# EAGLE design power_control (EAGLE 7.2.0)

## Sheet 1 of 5: Power
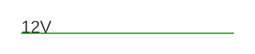
[diagram p0: schematic, sheet 1]

## Sheet 2 of 5: B-t-B
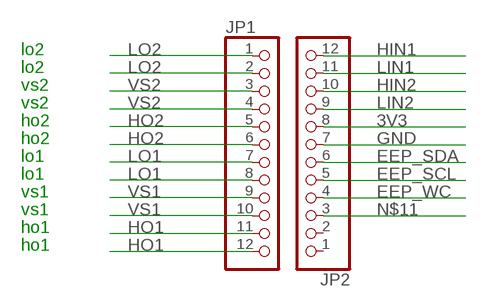
[diagram p1: schematic, sheet 2]

### Parts
JP1  PINHD-1X12_2.54-SMD  [1X12SMD]
JP2  PINHD-1X12_2.54-SMD  [1X12SMD]

### Nets
3V3: JP2.8 ; also sheet 4
EEP_SCL: JP2.5 ; also sheet 4
EEP_SDA: JP2.6 ; also sheet 4
EEP_WC: JP2.4 ; also sheet 4
GND: JP2.7 ; also sheet 3,4,5
HIN1: JP2.12 ; also sheet 3
HIN2: JP2.10 ; also sheet 3
HO1: JP1.11 JP1.12 ; also sheet 3
HO2: JP1.5 JP1.6 ; also sheet 3
LIN1: JP2.11 ; also sheet 3
LIN2: JP2.9 ; also sheet 3
LO1: JP1.7 JP1.8 ; also sheet 3
LO2: JP1.1 JP1.2 ; also sheet 3
N$11: JP2.3
VS1: JP1.9 JP1.10 ; also sheet 3
VS2: JP1.3 JP1.4 ; also sheet 3
Unconnected: JP2.1 JP2.2

### Notes on the sheet
- lo2
- lo2
- vs2
- vs2
- ho2
- ho2
- lo1
- lo1
- vs1
- vs1
- ho1
- ho1

## Sheet 3 of 5: IR2101
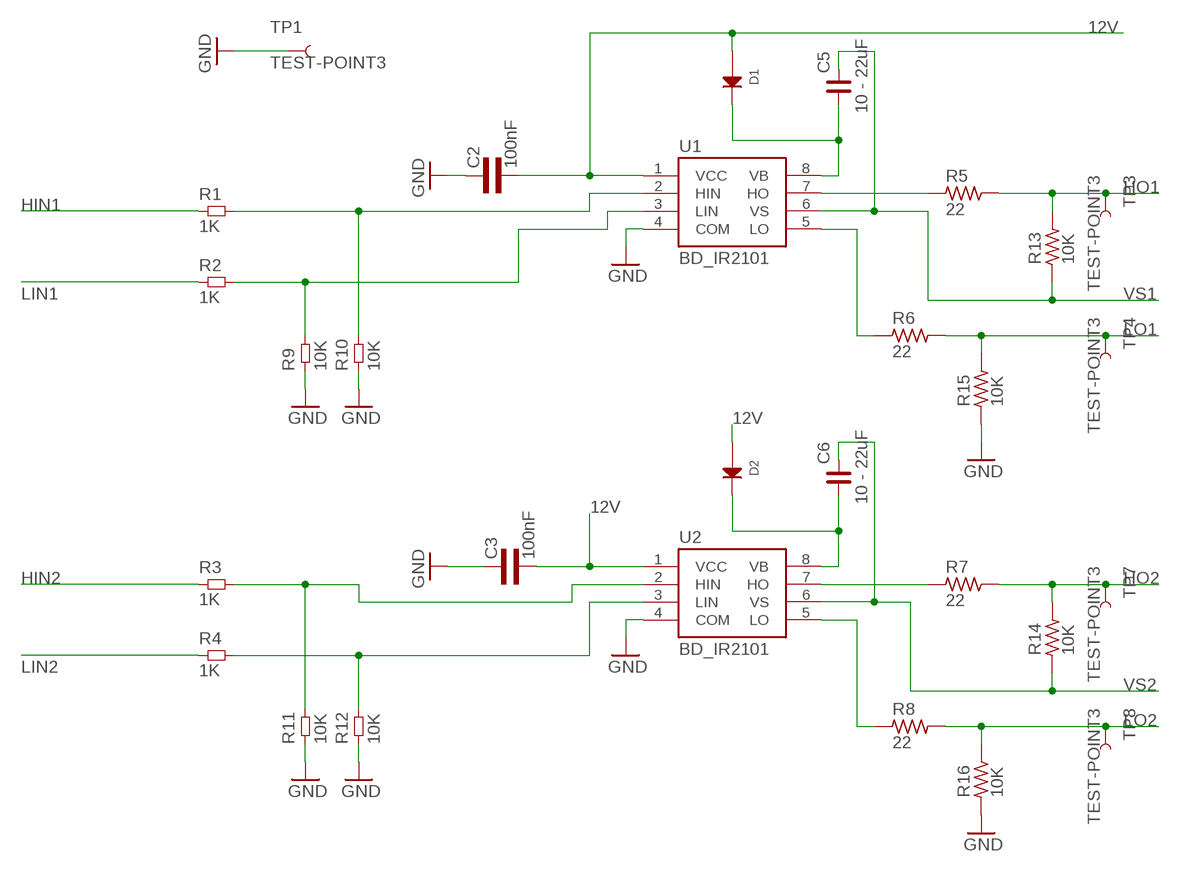
[diagram p2: schematic, sheet 3]

### Parts
C2  100nF  CAP0603L3  [0603L3]
C3  100nF  CAP0603L3  [0603L3]
C5  10 - 22uF  C_0805  [C0805]
C6  10 - 22uF  C_0805  [C0805]
D1  DIODETMINIP2-F2-B  [TMINIP2-F2-B]
D2  DIODETMINIP2-F2-B  [TMINIP2-F2-B]
R1  1K  RES0603L3  [0603L3]
R2  1K  RES0603L3  [0603L3]
R3  1K  RES0603L3  [0603L3]
R4  1K  RES0603L3  [0603L3]
R5  22  R_0805  [R0805]
R6  22  R_0805  [R0805]
R7  22  R_0805  [R0805]
R8  22  R_0805  [R0805]
R9  10K  RES0603L3  [0603L3]
R10  10K  RES0603L3  [0603L3]
R11  10K  RES0603L3  [0603L3]
R12  10K  RES0603L3  [0603L3]
R13  10K  R_0805  [R0805]
R14  10K  R_0805  [R0805]
R15  10K  R_0805  [R0805]
R16  10K  R_0805  [R0805]
TP1  TEST-POINT3  [PAD.03X.03]
TP3  TEST-POINT3  [PAD.03X.03]
TP4  TEST-POINT3  [PAD.03X.03]
TP7  TEST-POINT3  [PAD.03X.03]
TP8  TEST-POINT3  [PAD.03X.03]
U1  BD_IR2101  [SO8]
U2  BD_IR2101  [SO8]

### Nets
12V: C2.P$2 C3.P$2 D1.2(ANODE) D2.2(ANODE) U1.1(VCC) U2.1(VCC) ; also sheet 1,5
GND: C2.P$1 C3.P$1 R9.P$1 R10.P$1 R11.P$1 R12.P$1 R15.1 R16.1 TP1.P$1 U1.4(COM) U2.4(COM) ; also sheet 2,4,5
HIN1: R1.P$1 ; also sheet 2
HIN2: R3.P$1 ; also sheet 2
HO1: R5.2 R13.2 TP3.P$1 ; also sheet 2
HO1_OUT: R5.1 U1.7(HO)
HO2: R7.2 R14.2 TP7.P$1 ; also sheet 2
HO2_OUT: R7.1 U2.7(HO)
LIN1: R2.P$1 ; also sheet 2
LIN2: R4.P$1 ; also sheet 2
LO1: R6.2 R15.2 TP4.P$1 ; also sheet 2
LO2: R8.2 R16.2 TP8.P$1 ; also sheet 2
N$7: R1.P$2 R10.P$2 U1.2(HIN)
N$12: R2.P$2 R9.P$2 U1.3(LIN)
N$20: R6.1 U1.5(LO)
N$33: R3.P$2 R11.P$2 U2.2(HIN)
N$34: R4.P$2 R12.P$2 U2.3(LIN)
N$40: R8.1 U2.5(LO)
VB1: C5.1 D1.1(CATHODE) U1.8(VB)
VB2: C6.1 D2.1(CATHODE) U2.8(VB)
VS1: C5.2 R13.1 U1.6(VS) ; also sheet 2
VS2: C6.2 R14.1 U2.6(VS) ; also sheet 2

## Sheet 4 of 5: EEPROM
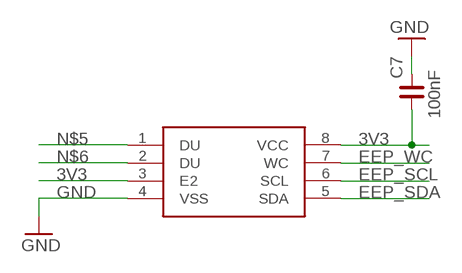
[diagram p3: schematic, sheet 4]

### Parts
C7  100nF  C_0201  [C0201]
M24M02  M24M02-DRMN6TP  [SO08]

### Nets
3V3: C7.1 M24M02.3(E2) M24M02.8(VCC) ; also sheet 2
EEP_SCL: M24M02.6(SCL) ; also sheet 2
EEP_SDA: M24M02.5(SDA) ; also sheet 2
EEP_WC: M24M02.7(WC) ; also sheet 2
GND: C7.2 M24M02.4(VSS) ; also sheet 2,3,5
N$5: M24M02.1(DU)
N$6: M24M02.2(DU)

## Sheet 5 of 5
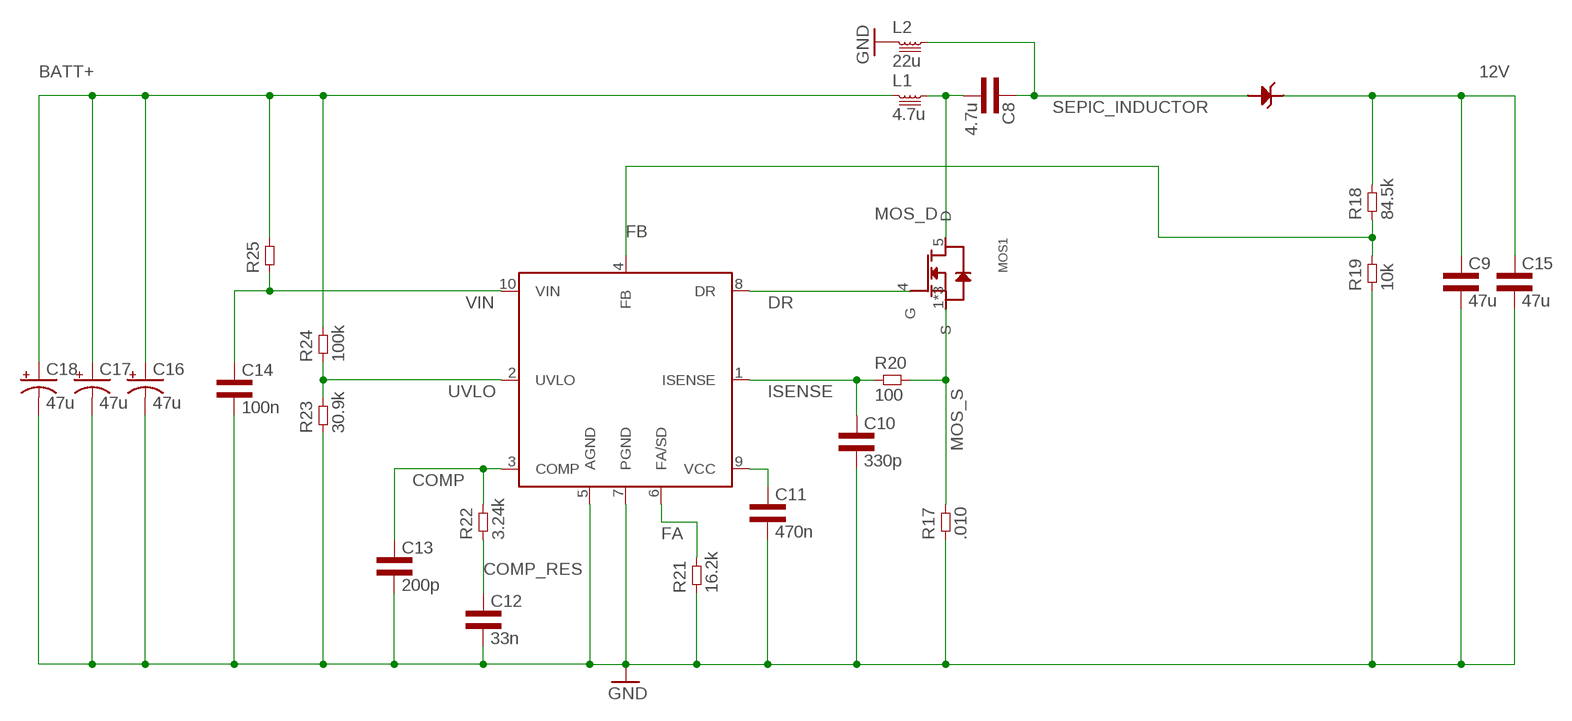
[diagram p4: schematic, sheet 5]

### Parts
C8  4.7u  CAP1206L3  [1206L3]
C9  47u  CAP1210L3  [1210L3]
C10  330p  CAP0402L3  [0402L3]
C11  470n  CAP0402L3  [0402L3]
C12  33n  CAP0402L3  [0402L3]
C13  200p  CAP0402L3  [0402L3]
C14  100n  CAP0603L3  [0603L3]
C15  47u  CAP1210L3  [1210L3]
C16  47u  CPOL-USCT7343  [CT7343]
C17  47u  CPOL-USCT7343  [CT7343]
C18  47u  CPOL-USCT7343  [CT7343]
D3  SCHOTTKYDIODEDPAK  [DPAK]
L1  4.7u  INDUCTORSRP6540  [SRP6540]
L2  22u  INDUCTORIHLP3232DZ11  [IHLP3232DZ11]
MOS1  MOSFET-NPG-TDSON-8  [PG-TDSON-8]
R17  .010  RES1206L3  [1206L3]
R18  84.5k  RES0402L3  [0402L3]
R19  10k  RES0402L3  [0402L3]
R20  100  RES0402L3  [0402L3]
R21  16.2k  RES0402L3  [0402L3]
R22  3.24k  RES0402L3  [0402L3]
R23  30.9k  RES0402L3  [0402L3]
R24  100k  RES0402L3  [0402L3]
R25  RES0402L3  [0402L3]
U3  LM3481  [S-PDSO-G10]

### Nets
12V: C9.P$1 C15.P$1 D3.TAB(CATHODE) R18.P$2 ; also sheet 1,3
BATT+: C16.+ C17.+ C18.+ L1.1 R24.P$2 R25.P$2
COMP: C13.P$1 R22.P$2 U3.3(COMP)
COMP_RES: C12.P$1 R22.P$1
DR: MOS1.4(G) U3.8(DR)
FA: R21.P$2 U3.6(FA/SD)
FB: R18.P$1 R19.P$2 U3.4(FB)
GND: C9.P$2 C10.P$2 C11.P$2 C12.P$2 C13.P$2 C14.P$2 C15.P$2 C16.- C17.- C18.- L2.1 R17.1 R19.P$1 R21.P$1 R23.P$1 U3.5(AGND) U3.7(PGND) ; also sheet 2,3,4
ISENSE: C10.P$1 R20.P$1 U3.1(ISENSE)
MOS_D: C8.2 L1.2 MOS1.5(D)
MOS_S: MOS1.1(S) MOS1.2(S) MOS1.3(S) R17.2 R20.P$2
N$14: C11.P$1 U3.9(VCC)
SEPIC_INDUCTOR: C8.1 D3.1(ANODE) D3.3(ANODE) L2.2
UVLO: R23.P$2 R24.P$1 U3.2(UVLO)
VIN: C14.P$1 R25.P$1 U3.10(VIN)

## Library data of the parts
C2 C3 C8-C15 = common:CAP
C5-C7 = rc-master-smd:C_: NON-POLARIZED CAP
C16-C18 = rcl:CPOL-US: POLARIZED CAPACITOR, American symbol
D1 D2 = common:DIODE; PARTNUM: DB2441600L
D3 = common:SCHOTTKYDIODE
JP1 JP2 = pinhead-1:PINHD-1X12: PIN HEADER
L1 L2 = common:INDUCTOR
M24M02 = st-microelectronics:M24M02-DRMN6TP
MOS1 = common:MOSFET-N
R1-R4 R9-R12 R17-R25 = common:RES
R5-R8 R13-R16 = rc-master-smd:R_: RESISTOR
TP1 TP3 TP4 TP7 TP8 = SparkFun-Passives:TEST-POINT: Bare copper test points for troubleshooting or ICT
U1 U2 = open-bldc:BD
U3 = common:LM3481

## Board
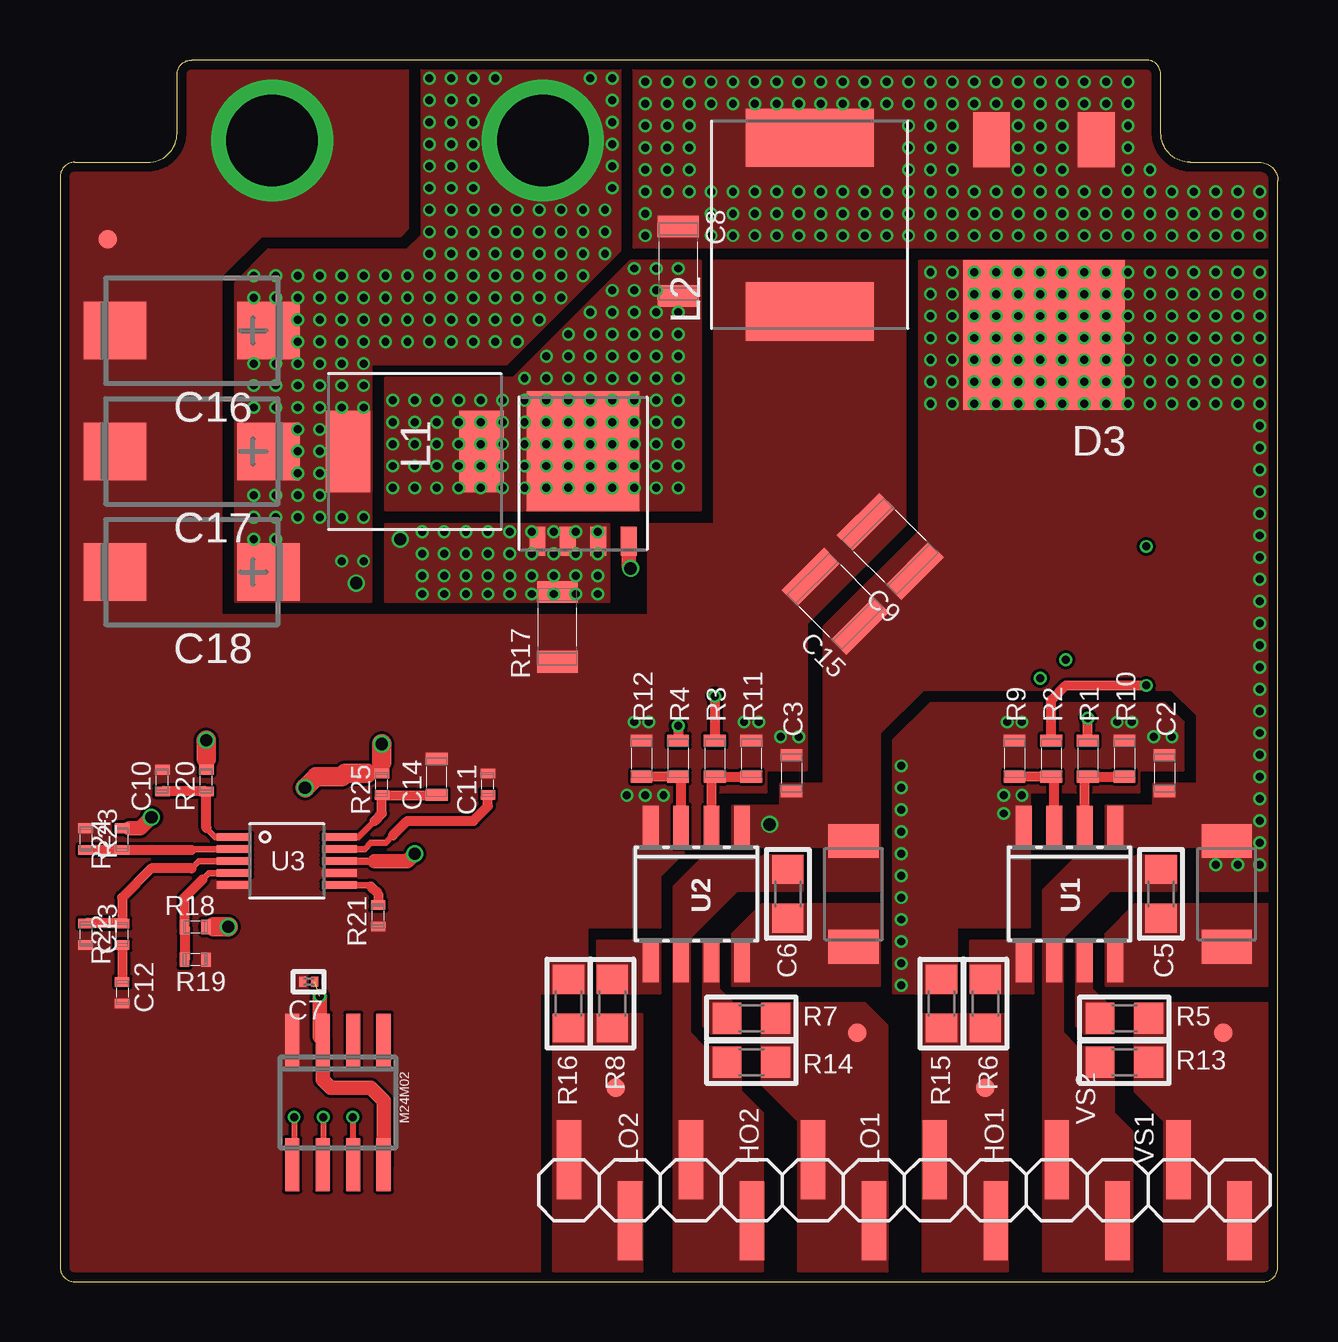
[diagram p5: board, top side]
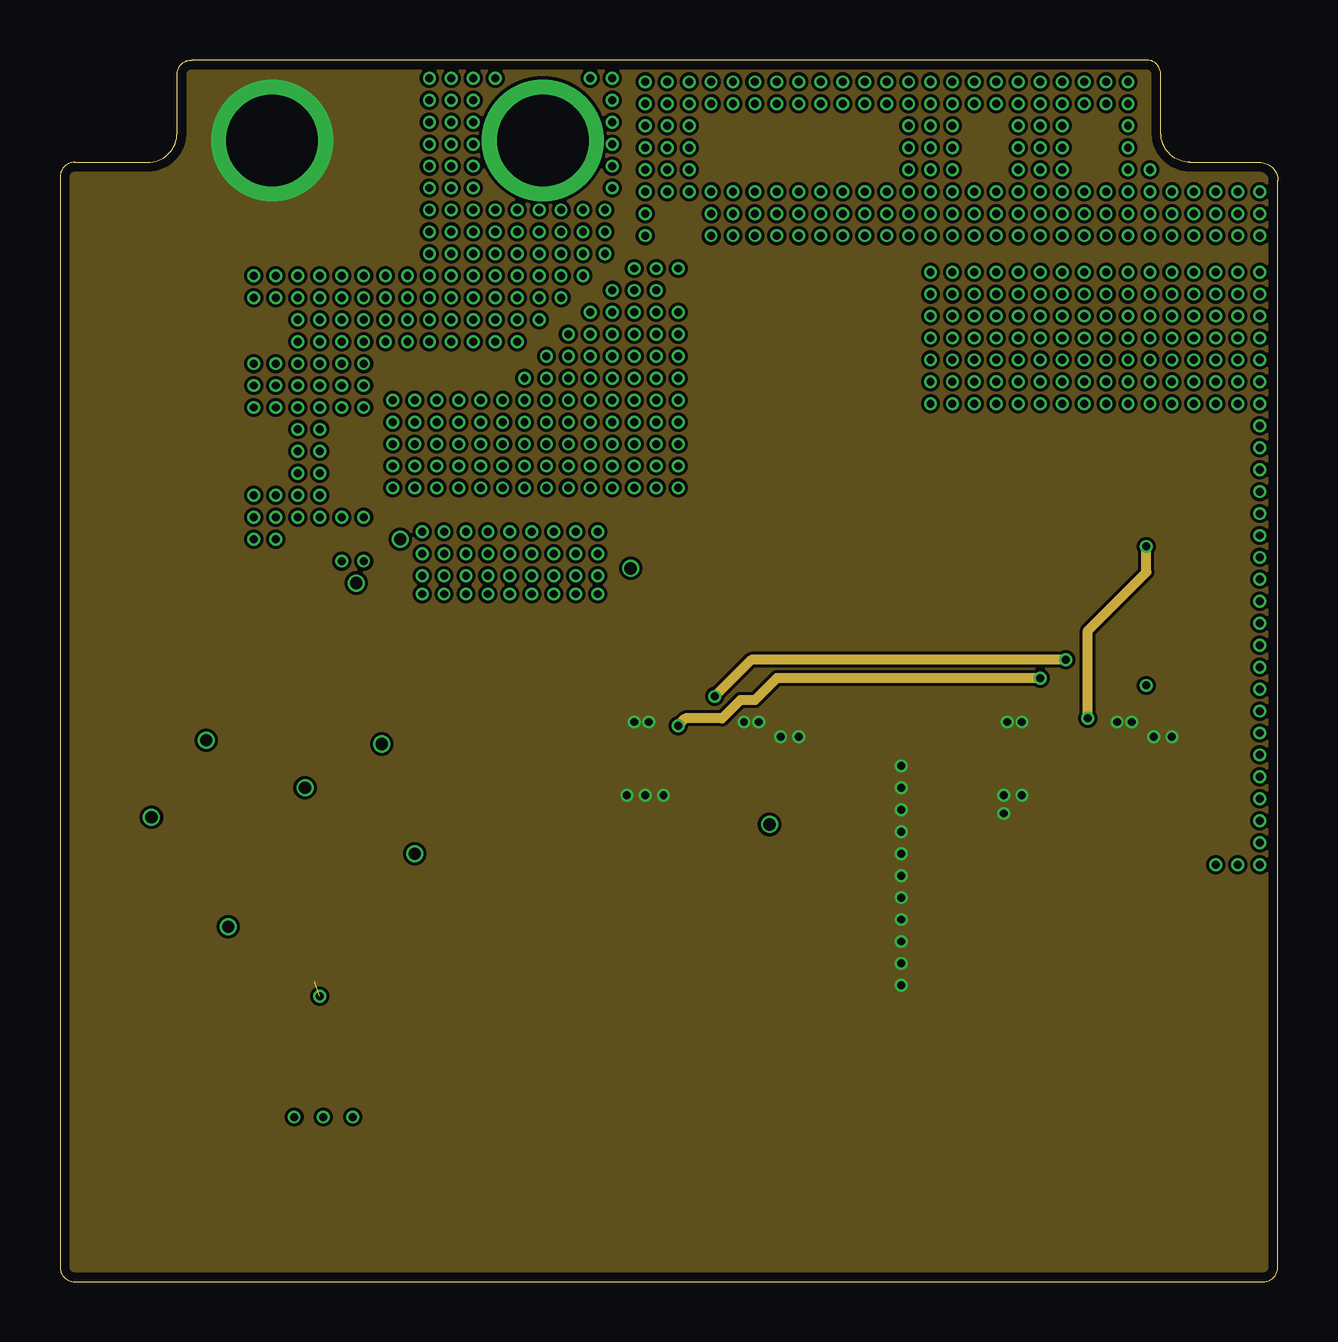
[diagram p6: board, inner layer Route2]
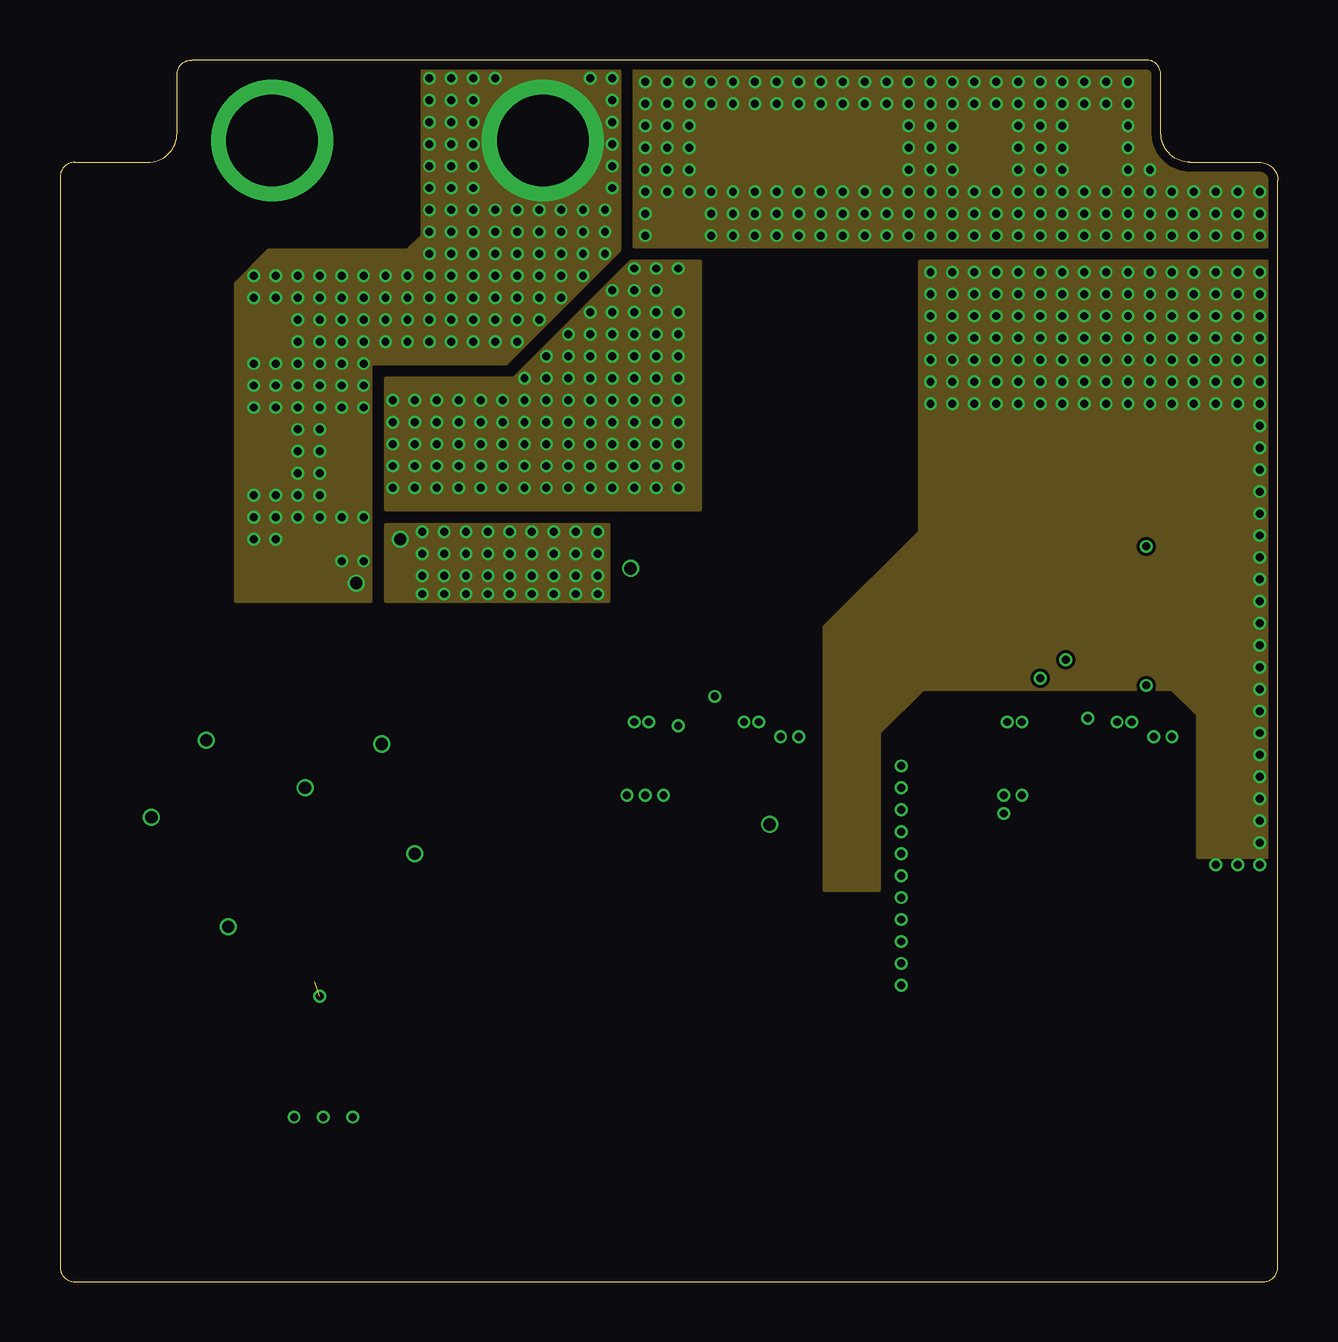
[diagram p7: board, inner layer Route3]
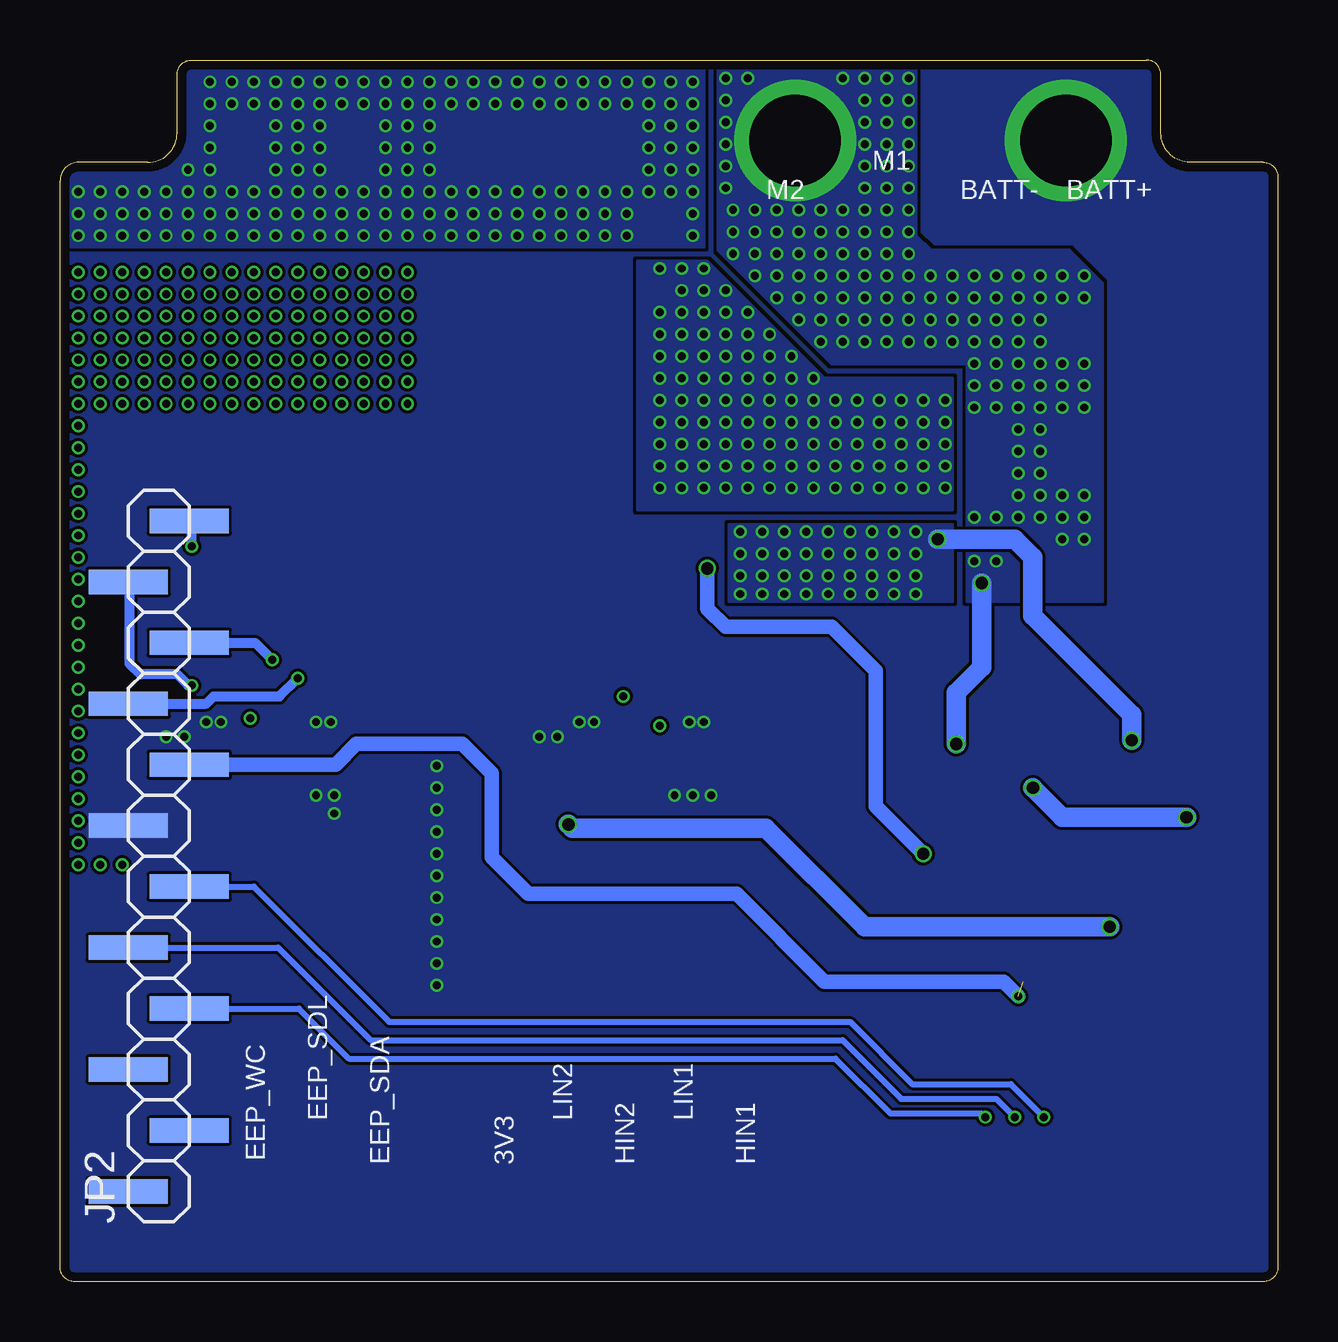
[diagram p8: board, bottom side, seen from below]

Size 50.75 x 50.9 mm. Coordinates in mm from the lower left corner, seen from the top.
Outline: 0.61,0 50.14,0 arc90 50.75,0.61 50.75,45.87 arc90 49.99,46.63 47.09,46.63 arc-90 45.87,47.85 45.87,50.29 arc90 45.26,50.9 5.49,50.9 arc90 4.88,50.29 4.88,47.85 arc-90 3.66,46.63 0.61,46.63 arc90 0,46.02 0,0.61 arc90 0.61,0
Copper layers (1*2*3*16): Top 0.035559375mm / dielectric 0.17018125mm / Route2 0.01778125mm / dielectric 47mil / Route3 0.01778125mm / dielectric 0.17018125mm / Bottom 0.035559375mm
Design rules "LaenPCBOrder *": minimum track width 5mil, minimum drill 10mil, track to track 5mil, track to pad 5mil, pad to pad 5mil, via to via 5mil, smd to smd 0mil, copper to edge 15mil, drill to drill 6mil, minimum pad ring 4mil, minimum via ring 4mil, stop-mask expansion 4mil, vias tented up to drill 21mil, thermal gap 10mil

### Footprints (pad centres in the part's own frame; a part is rotated, then mirrored left to right if it is on the bottom)
0603L3 = smd 0.5 x 0.9: P$1 -0.75,0; P$2 0.75,0
C0805 = smd 1.2 x 1.3: 1 -1.016,0; 2 1.016,0
C0201 = smd 0.3 x 0.4: 1 -0.254,0; 2 0.254,0
1206L3 = smd 0.9 x 1.7: 1 -1.45,0; 2 1.45,0
1210L3 = smd 0.9 x 2.5: P$1 -1.45,0; P$2 1.45,0
0402L3 = smd 0.4 x 0.6: P$1 -0.45,0; P$2 0.45,0
CT7343 = smd 2.6 x 2.4: + -3.2,0; - 3.2,0
TMINIP2-F2-B = smd 1.4 x 2.1: 1 -2.2,0; 2 2.2,0
DPAK = smd 1.524 x 2.28: 1 -2.18,-5.06; 3 2.18,-5.06 | smd 6.74 x 6.23: TAB 0,3.085
1X12SMD = smd 1.016 x 3.302: 1 -1.27,1.27; 2 1.27,-1.27; 3 3.81,1.27; 4 6.35,-1.27; 5 8.89,1.27; 6 11.43,-1.27; 7 13.97,1.27; 8 16.51,-1.27; 9 19.05,1.27; 10 21.59,-1.27; 11 24.13,1.27; 12 26.67,-1.27
SRP6540 = smd 1.85 x 3.4: 1 -2.775,0; 2 2.775,0
IHLP3232DZ11 = smd 2.423 x 5.334: 1 -3.619,0; 2 3.619,0
SO08 = smd 0.6 x 2.2: 1 -1.905,-2.6; 2 -0.635,-2.6; 3 0.635,-2.6; 4 1.905,-2.6; 5 1.905,2.6; 6 0.635,2.6; 7 -0.635,2.6; 8 -1.905,2.6
PG-TDSON-8 = smd 0.65 x 1.2: 1 -1.905,-2.825; 2 -0.635,-2.825; 3 0.635,-2.825; 4 1.905,-2.825 | smd 4.7 x 5: 5 0,0.925
R0805 = smd 1.2 x 1.3: 1 -1.016,0; 2 1.016,0
PAD.03X.03 = smd 0.762 x 0.762: P$1 0,0
SO8 = smd 0.65 x 1.75: 1 -1.905,-2.8; 2 -0.635,-2.8; 3 0.635,-2.8; 4 1.905,-2.8; 5 1.905,2.8; 6 0.635,2.8; 7 -0.635,2.8; 8 -1.905,2.8
S-PDSO-G10 = smd 0.3 x 1.45: 1 -1,-2.2; 2 -0.5,-2.2; 3 0,-2.2; 4 0.5,-2.2; 5 1,-2.2; 6 1,2.2; 7 0.5,2.2; 8 0,2.2; 9 -0.5,2.2; 10 -1,2.2

### Placement (x,y rotation side)
C2  46.02,21.18 270 top
C3  30.48,21.18 270 top
C5  45.87,16.15 90 top
C6  30.33,16.15 90 top
C7  10.36,12.5 180 top
C8  25.76,42.52 270 top
C9  34.59,30.63 135 top
C10  4.27,20.88 90 top
C11  17.83,20.73 90 top
C12  2.59,12.04 270 top
C13  1.07,14.48 270 top
C14  15.7,21.03 90 top
C15  32.31,28.35 135 top
C16  5.49,39.62 180 top
C17  5.49,34.59 180 top
C18  5.49,29.57 180 top
D1  48.62,16.15 90 top
D2  33.07,16.15 90 top
D3  41,42.52 180 top
JP1  22.48,3.81 0 top
JP2  46.63,5.03 90 bottom
L1  14.78,34.59 0 top
L2  31.24,44.04 90 top
M24M02  11.58,7.47 180 top
MOS1  21.79,33.68 0 top
R1  42.82,21.79 270 top
R2  41.3,21.79 270 top
R3  27.28,21.79 270 top
R4  25.76,21.79 270 top
R5  44.35,10.97 0 top
R6  38.56,11.58 270 top
R7  28.8,10.97 0 top
R8  23.01,11.58 270 top
R9  39.78,21.79 270 top
R10  44.35,21.79 270 top
R11  28.8,21.79 270 top
R12  24.23,21.79 270 top
R13  44.35,9.14 0 top
R14  28.8,9.14 0 top
R15  36.73,11.58 270 top
R16  21.18,11.58 270 top
R17  20.73,27.28 90 top
R18  5.64,14.78 0 top
R19  5.64,13.41 180 top
R20  6.1,20.88 90 top
R21  13.26,15.24 90 top
R22  2.59,14.48 90 top
R23  1.07,18.44 270 top
R24  2.59,18.44 90 top
R25  13.41,20.73 90 top
TP1  1.98,43.43 0 top
TP3  48.46,10.36 0 top
TP4  38.56,8.08 0 top
TP7  33.22,10.36 0 top
TP8  23.16,8.08 0 top
U1  42.06,16.15 180 top
U2  26.52,16.15 180 top
U3  9.45,17.53 270 top

### Tracks (layer width: path | path; a pad name or v marks a point on that pad's centre or on a via)
3V3  (via drill 0.33)  (1 unrouted)
  Top 0.61: v10.82,11.89 10.82,10.19 M24M02.3 10.95,8.41 11.28,8.08 12.95,8.08 13.49,7.54 M24M02.8
  Bottom 0.61: JP2.8 39.27,21.54 38.41,22.4 33.98,22.4 32.77,21.18 32.77,17.68 31.24,16.15 22.56,16.15 18.9,12.5 11.43,12.5 v10.82,11.89
12V  (via drill 0.33, 0.51)
  Top 0.406: R18.P$2 6.4,14.78
  Top 0.813: 6.4,14.78 v7.01,14.78
  Bottom 0.813: v29.57,19.05 29.41,18.9 21.34,18.9 17.22,14.78 v7.01,14.78
  other vias: 36.27,42.06 37.19,42.06 38.1,42.06 39.01,42.06 39.93,42.06 40.84,42.06 41.76,42.06 42.67,42.06 43.59,42.06 44.5,42.06 45.42,42.06 46.33,42.06 47.24,42.06 48.16,42.06 49.07,42.06 49.99,42.06 49.99,41.15 49.99,40.23 49.99,39.32 49.99,38.4 49.99,37.49 49.99,36.58 49.99,35.66 49.99,34.75 49.99,33.83 49.99,32.92 49.99,32 49.99,31.09 49.99,30.18 49.99,29.26 49.99,28.35 49.99,27.43 49.99,26.52 49.99,25.6 49.99,24.69 49.99,23.77 49.99,22.86 49.99,21.95 49.99,21.03 49.99,20.12 49.99,19.2 49.99,18.29 49.99,17.37 49.07,17.37 48.16,17.37 49.07,41.15 49.07,40.23 49.07,39.32 49.07,38.4 49.07,37.49 49.07,36.58 48.16,41.15 48.16,40.23 48.16,39.32 48.16,38.4 48.16,37.49 48.16,36.58 36.27,41.15 36.27,40.23 36.27,39.32 36.27,38.4 36.27,37.49 36.27,36.58 37.19,41.15 38.1,41.15 39.01,41.15 39.93,41.15 40.84,41.15 41.76,41.15 37.19,40.23 38.1,40.23 39.01,40.23 39.93,40.23 40.84,40.23 41.76,40.23 37.19,39.32 38.1,39.32 37.19,38.4 37.19,37.49 37.19,36.58 38.1,38.4 38.1,37.49 38.1,36.58 39.01,39.32 39.01,38.4 39.01,37.49 39.01,36.58 39.93,39.32 39.93,38.4 39.93,37.49 39.93,36.58 40.84,39.32 40.84,38.4 40.84,37.49 40.84,36.58 41.76,39.32 41.76,38.4 41.76,37.49 41.76,36.58 42.67,41.15 43.59,41.15 44.5,41.15 45.42,41.15 46.33,41.15 47.24,41.15 42.67,40.23 43.59,40.23 44.5,40.23 45.42,40.23 46.33,40.23 47.24,40.23 42.67,39.32 43.59,39.32 44.5,39.32 45.42,39.32 46.33,39.32 47.24,39.32 42.67,38.4 43.59,38.4 44.5,38.4 45.42,38.4 46.33,38.4 47.24,38.4 42.67,37.49 43.59,37.49 44.5,37.49 45.42,37.49 46.33,37.49 47.24,37.49 42.67,36.58 43.59,36.58 44.5,36.58 45.42,36.58 46.33,36.58 47.24,36.58
  pour Top (no thermals): 28.04,19.81 30.02,19.81 30.02,20.73 34.14,20.73 34.14,17.68 32,17.68 32,18.14 28.04,18.14
  pour Top (no thermals): 43.59,19.81 45.57,19.81 45.57,20.73 50.29,20.73 50.29,16.31 47.4,16.31 47.4,18.14 43.59,18.14
  pour Top (no thermals): 34.14,16.31 34.14,22.86 35.97,24.69 46.33,24.69 47.4,23.62 47.4,17.68 50.29,17.68 50.29,42.52 35.81,42.52 35.81,31.24 31.85,27.28 31.85,16.31
  pour Route3 (no thermals): 34.14,16.31 34.14,22.86 35.97,24.69 46.33,24.69 47.4,23.62 47.4,17.68 50.29,17.68 50.29,42.52 35.81,42.52 35.81,31.24 31.85,27.28 31.85,16.31
BATT+  (via drill 0.33, 0.51, 3.81 pad 5.08)
  Top 0.406: 13.41,21.64 R25.P$2 12.8,21.18 | R24.P$2 2.89,18.89 2.9,18.9
  Top 0.61: 2.9,18.9 3.35,18.9 v3.81,19.35
  Top 0.813: v13.41,22.4 13.41,21.64 | v10.21,20.57 10.67,21.03 11.73,21.03 11.89,21.18 12.8,21.18
  Bottom 0.813: v12.34,29.11 12.34,25.6 13.41,24.54 v13.41,22.4 | v3.81,19.35 8.99,19.35 v10.21,20.57
  other vias: 20.12,47.55 15.39,50.14 16.31,50.14 17.22,50.14 18.14,50.14 15.39,49.23 16.31,49.23 17.22,49.23 15.39,48.31 16.31,48.31 17.22,48.31 15.39,47.4 16.31,47.4 17.22,47.4 23.01,50.14 22.1,50.14 23.01,49.23 23.01,48.31 23.01,47.4 15.39,46.48 16.31,46.48 17.22,46.48 23.01,46.48 23.01,45.57 15.39,44.65 16.31,44.65 17.22,44.65 18.14,44.65 19.05,44.65 19.96,44.65 20.88,44.65 21.79,44.65 22.71,44.65 21.79,43.74 20.88,43.74 19.96,43.74 19.05,43.74 18.14,43.74 17.22,43.74 16.31,43.74 15.39,43.74 8.99,41.91 8.08,41.91 9.91,41.91 10.82,41.91 12.65,41.91 14.48,41.91 16.31,41.91 15.39,41.91 15.39,42.82 16.31,42.82 17.22,42.82 18.14,42.82 19.05,42.82 19.96,42.82 20.88,42.82 8.99,41 8.08,41 11.73,41.91 13.56,41.91 21.79,41.91 20.88,41.91 19.96,41.91 19.05,41.91 18.14,41.91 17.22,41.91 22.71,42.82 21.79,42.82 15.39,45.57 16.31,45.57 17.22,45.57 22.71,43.74 9.91,41 10.82,41 11.73,41 12.65,41 13.56,41 14.48,41 15.39,41 16.31,41 17.22,41 18.14,41 19.05,41 19.96,41 20.88,41 19.96,40.08 19.05,40.08 19.05,39.17 18.14,40.08 18.14,39.17 17.22,40.08 17.22,39.17 16.31,39.17 16.31,40.08 15.39,40.08 15.39,39.17 14.48,39.17 14.48,40.08 13.56,40.08 12.65,40.08 13.56,39.17 12.65,39.17 11.73,40.08 10.82,40.08 9.91,40.08 11.73,39.17 10.82,39.17 9.91,39.17 9.91,38.25 10.82,38.25 11.73,38.25 12.65,38.25 9.91,37.34 9.91,36.42 9.91,35.51 10.82,37.34 11.73,37.34 12.65,37.34 10.82,36.42 11.73,36.42 12.65,36.42 10.82,35.51 8.99,38.25 8.08,38.25 8.08,37.34 8.99,37.34 8.99,36.42 8.08,36.42 9.91,34.59 9.91,33.68 10.82,34.59 10.82,33.68 9.91,32.77 10.82,32.77 8.99,32.77 8.08,32.77 8.08,31.85 8.99,31.85 9.91,31.85 10.82,31.85 11.73,31.85 12.65,31.85 8.08,30.94 8.99,30.94 11.73,30.02 12.65,30.02
  pour Top (no thermals): 15.09,50.9 15.09,43.59 14.48,42.98 8.69,42.98 7.32,41.61 7.32,28.35 12.95,28.35 12.95,38.25 18.59,38.25 23.32,42.98 23.32,50.9
  pour Route3 (no thermals): 15.09,50.9 15.09,43.59 14.48,42.98 8.69,42.98 7.32,41.61 7.32,28.35 12.95,28.35 12.95,38.25 18.59,38.25 23.32,42.98 23.32,50.9
  pour Bottom (no thermals): 15.09,50.9 15.09,43.59 14.48,42.98 8.69,42.98 7.32,41.61 7.32,28.35 12.95,28.35 12.95,38.25 18.59,38.25 23.32,42.98 23.32,50.9
COMP
  Top 0.279: U3.3 5.79,17.53 5.49,17.22
  Top 0.406: 5.49,17.22 3.81,17.22 2.59,16 R22.P$2 C13.P$1
COMP_RES
  Top 0.406: R22.P$1 C12.P$1
DR  (via drill 0.51)
  Top 0.305: U3.8 13.11,17.53
  Top 0.61: MOS1.4 23.7,29.79 v23.77,29.72 | 13.11,17.53 14.48,17.53 v14.78,17.83
  Bottom 0.61: v23.77,29.72 23.77,28.04 23.01,27.28 18.59,27.28 16.76,25.45 16.76,19.81 v14.78,17.83
EEP_SCL  (via drill 0.33)
  Top 0.254: v10.97,6.86 10.97,4.89 M24M02.6
  Bottom 0.254: JP2.5 41.66,13.92 37.8,10.06 18.14,10.06 15.7,7.62 11.73,7.62 v10.97,6.86
EEP_SDA  (via drill 0.33)
  Top 0.254: v9.75,6.86 9.75,4.94 M24M02.5
  Bottom 0.254: JP2.6 42.67,16.46 37.03,10.82 17.83,10.82 15.24,8.23 11.12,8.23 v9.75,6.86
EEP_WC  (via drill 0.33)
  Top 0.254: v12.19,6.86 12.19,4.89 M24M02.7
  Bottom 0.254: JP2.4 40.79,11.38 38.71,9.3 18.44,9.3 16.15,7.01 12.34,7.01 v12.19,6.86
FA
  Top 0.279: U3.6 12.89,16.53 12.95,16.46
  Top 0.406: 12.95,16.46 13.26,16.15 R21.P$2
FB
  Top 0.279: U3.4 6.21,17.03 5.94,16.76
  Top 0.406: 5.94,16.76 5.19,16.01 R18.P$1 R19.P$2
GND  (via drill 0.33, 3.81 pad 5.08)
  other vias: 8.84,47.55 35.05,12.34 35.05,13.26 35.05,14.17 35.05,15.09 35.05,16 35.05,16.92 35.05,17.83 35.05,18.75 35.05,19.66 35.05,20.57 35.05,21.49 44.04,23.32 45.57,22.71 39.47,23.32 40.08,23.32 44.65,23.32 46.33,22.71 30.02,22.71 30.78,22.71 28.5,23.32 29.11,23.32 23.93,23.32 24.54,23.32 25.15,20.27 24.38,20.27 23.62,20.27 40.08,20.27 39.32,20.27 39.32,19.51
  pour Top (no thermals): 14.48,50.44 0.3,50.44 0.3,0.15 19.96,0.15 19.96,12.04 21.95,12.04 21.95,14.78 24.99,14.78 24.99,16.92 26.21,18.14 27.43,18.14 27.43,20.42 29.41,20.42 29.41,21.34 31.09,21.34 31.09,27.43 35.2,31.55 35.2,42.52 27.28,42.52 27.28,31.55 24.54,31.55 24.54,27.74 6.71,27.74 6.71,41.91 8.38,43.59 14.17,43.59 14.48,43.89
  pour Top (no thermals): 34.75,12.04 34.75,22.56 36.27,24.08 46.02,24.08 46.79,23.32 46.79,21.34 44.96,21.34 44.96,20.42 40.39,20.42 40.39,14.78 37.34,14.78 37.34,12.04
  pour Bottom (rank 6, no thermals): 50.6,0.15 0.15,0.15 0.15,50.75 45.11,50.75 50.6,50.75
  pour Route2 (no thermals): 50.6,0.15 0.15,0.15 0.15,50.75 45.11,50.75 50.6,50.75
HIN1  (via drill 0.33)
  Top 0.406: R1.P$1 v42.82,23.47
  Route2 0.406: v42.82,23.47 42.82,27.13 45.26,29.57 v45.26,30.63
  Bottom 0.406: v45.26,30.63 45.26,31.6 JP2.12
HIN2  (via drill 0.33)
  Top 0.406: v27.28,24.38 R3.P$1
  Route2 0.406: v41.91,25.91 28.8,25.91 v27.28,24.38
  Bottom 0.406: JP2.10 42.62,26.62 v41.91,25.91
HO1
  pour Top (no thermals): 44.81,11.58 44.81,7.92 46.02,6.71 46.02,0.46 50.6,0.46 50.6,11.58
HO1_OUT
  pour Top (no thermals): 42.98,14.17 42.98,12.19 43.59,11.58 43.89,11.58 43.89,10.36 42.67,10.36 42.37,10.67 42.37,14.17
HO2
  pour Top (no thermals): 29.26,11.58 33.53,11.58 34.44,10.67 34.44,0.46 30.78,0.46 30.78,6.71 29.26,8.23
HO2_OUT
  pour Top (no thermals): 27.43,14.17 27.43,12.19 28.04,11.58 28.35,11.58 28.35,10.36 27.13,10.36 26.82,10.67 26.82,14.17
ISENSE
  Top 0.279: U3.1 6.47,18.53 6.1,18.9
  Top 0.406: 6.1,18.9 R20.P$1 C10.P$1
LIN1  (via drill 0.33)
  Top 0.406: R2.P$1 41.3,24.23 41.91,24.84 v45.26,24.84
  Bottom 0.406: v45.26,24.84 45.42,24.84 45.87,25.3 47.4,25.3 47.85,25.76 47.85,29.11 JP2.11
LIN2  (via drill 0.33)
  Top 0.406: v25.76,23.16 R4.P$1
  Route2 0.406: v40.84,25.15 29.87,25.15 28.96,24.23 28.35,24.23 27.58,23.47 26.06,23.47 v25.76,23.16
  Bottom 0.406: JP2.9 44.65,24.08 44.35,24.38 41.61,24.38 v40.84,25.15
LO1
  pour Top (no thermals): 35.97,11.13 39.47,11.13 39.47,0.46 35.97,0.46
LO2
  pour Top (no thermals): 20.57,11.13 20.57,0.46 24.23,0.46 24.23,11.13
MOS_D  (via drill 0.33)
  other vias: 23.93,42.21 24.84,42.21 25.76,42.21 23.93,41.3 23.01,41.3 24.84,41.3 23.01,40.39 23.01,39.47 23.01,38.56 23.93,40.39 23.93,39.47 23.93,38.56 24.84,40.39 25.76,40.39 24.84,39.47 25.76,39.47 24.84,38.56 25.76,38.56 22.1,40.39 22.1,39.47 21.18,39.47 22.1,38.56 21.18,38.56 20.27,38.56 25.76,37.64 25.76,36.73 25.76,35.81 25.76,34.9 25.76,33.99 24.84,37.64 23.93,37.64 23.01,37.64 22.1,37.64 21.18,37.64 20.27,37.64 19.35,37.64 24.84,36.73 23.93,36.73 23.01,36.73 22.1,36.73 21.18,36.73 20.27,36.73 19.35,36.73 18.44,36.73 17.53,36.73 16.61,36.73 15.7,36.73 14.78,36.73 13.87,36.73 13.87,35.81 13.87,34.9 13.87,33.99 13.87,33.07 14.78,35.81 15.7,35.81 16.61,35.81 17.53,35.81 18.44,35.81 19.35,35.81 20.27,35.81 21.18,35.81 22.1,35.81 23.01,35.81 14.78,34.9 15.7,34.9 16.61,34.9 17.53,34.9 18.44,34.9 19.35,34.9 20.27,34.9 21.18,34.9 22.1,34.9 23.01,34.9 14.78,33.99 15.7,33.99 16.61,33.99 17.53,33.99 18.44,33.99 19.35,33.99 20.27,33.99 21.18,33.99 22.1,33.99 23.01,33.99 14.78,33.07 15.7,33.07 16.61,33.07 17.53,33.07 18.44,33.07 19.35,33.07 20.27,33.07 21.18,33.07 22.1,33.07 23.01,33.07 23.93,35.81 24.84,35.81 24.84,34.9 24.84,33.99 24.84,33.07 25.76,33.07 23.93,33.07 23.93,33.99 23.93,34.9
  pour Top (no thermals): 13.56,32.16 13.56,37.64 18.9,37.64 23.77,42.52 26.67,42.52 26.67,32.16
  pour Route3 (no thermals): 13.56,32.16 13.56,37.64 18.9,37.64 23.77,42.52 26.67,42.52 26.67,32.16
  pour Bottom (no thermals): 13.56,32.16 13.56,37.64 18.9,37.64 23.77,42.52 26.67,42.52 26.67,32.16
MOS_S  (via drill 0.33, 0.51)
  Top 0.406: 6.1,21.79 R20.P$2
  Top 0.813: v6.1,22.56 6.1,21.79
  Bottom 0.813: v14.17,30.94 10.97,30.94 10.21,30.18 10.21,27.74 6.1,23.62 v6.1,22.56
  other vias: 15.09,31.24 16,31.24 16.92,31.24 17.83,31.24 18.75,31.24 19.66,31.24 20.57,31.24 21.49,31.24 22.4,31.24 15.09,30.33 15.09,29.41 15.09,28.65 16,30.33 16.92,30.33 17.83,30.33 18.75,30.33 19.66,30.33 20.57,30.33 21.49,30.33 22.4,30.33 16,29.41 16.92,29.41 17.83,29.41 18.75,29.41 19.66,29.41 20.57,29.41 21.49,29.41 22.4,29.41 16,28.65 16.92,28.65 17.83,28.65 18.75,28.65 19.66,28.65 20.57,28.65 21.49,28.65 22.4,28.65
  pour Top (no thermals): 13.56,31.55 22.86,31.55 22.86,28.35 13.56,28.35
  pour Route3 (no thermals): 13.56,31.55 22.86,31.55 22.86,28.35 13.56,28.35
  pour Bottom (no thermals): 13.56,31.55 22.86,31.55 22.86,28.35 13.56,28.35
N$7
  Top 0.406: U1.2 42.7,20.92 R1.P$2 R10.P$2
N$12
  Top 0.406: U1.3 41.43,20.92 R2.P$2 R9.P$2
N$14
  Top 0.279: U3.9 12.69,18.03 12.95,18.29 13.56,18.29 13.87,18.59
  Top 0.406: 13.87,18.59 14.48,19.2 17.22,19.2 17.83,19.81 C11.P$1
N$20
  pour Top (no thermals): 40.54,14.17 37.95,14.17 37.95,12.04 40.54,12.04
N$33
  Top 0.406: U2.2 27.15,20.92 R3.P$2 R11.P$2
N$34
  Top 0.406: U2.3 25.88,20.92 R4.P$2 R12.P$2
N$40
  pour Top (no thermals): 24.99,14.17 22.4,14.17 22.4,12.04 24.99,12.04
SEPIC_INDUCTOR  (via drill 0.33)
  other vias: 24.38,49.99 24.38,49.07 24.38,48.16 24.38,47.24 24.38,46.33 24.38,45.42 24.38,44.5 24.38,43.59 25.3,49.99 25.3,49.07 25.3,48.16 25.3,47.24 25.3,46.33 25.3,45.42 26.21,49.99 26.21,49.07 26.21,48.16 26.21,47.24 26.21,46.33 26.21,45.42 27.13,49.99 27.13,49.07 28.04,49.99 28.04,49.07 28.96,49.99 29.87,49.99 30.78,49.99 31.7,49.99 32.61,49.99 33.53,49.99 34.44,49.99 35.36,49.99 36.27,49.99 37.19,49.99 38.1,49.99 39.01,49.99 39.93,49.99 40.84,49.99 41.76,49.99 28.96,49.07 29.87,49.07 30.78,49.07 31.7,49.07 32.61,49.07 33.53,49.07 34.44,49.07 35.36,49.07 36.27,49.07 36.27,48.16 36.27,47.24 36.27,46.33 36.27,45.42 36.27,44.5 36.27,43.59 37.19,49.07 37.19,48.16 37.19,47.24 37.19,46.33 37.19,45.42 37.19,44.5 37.19,43.59 38.1,45.42 38.1,44.5 38.1,43.59 38.1,49.07 39.01,49.07 39.93,49.07 40.84,49.07 41.76,49.07 39.01,45.42 39.93,45.42 40.84,45.42 41.76,45.42 42.67,45.42 43.59,45.42 44.5,45.42 45.42,45.42 46.33,45.42 47.24,45.42 48.16,45.42 49.07,45.42 49.99,45.42 49.99,44.5 49.99,43.59 39.01,44.5 39.93,44.5 40.84,44.5 41.76,44.5 42.67,44.5 43.59,44.5 44.5,44.5 45.42,44.5 46.33,44.5 47.24,44.5 48.16,44.5 49.07,44.5 39.01,43.59 39.93,43.59 40.84,43.59 41.76,43.59 42.67,43.59 43.59,43.59 44.5,43.59 45.42,43.59 46.33,43.59 47.24,43.59 48.16,43.59 49.07,43.59 39.93,48.16 39.93,47.24 39.93,46.33 40.84,48.16 40.84,47.24 40.84,46.33 41.76,48.16 41.76,47.24 41.76,46.33 42.67,49.99 43.59,49.99 44.5,49.99 42.67,49.07 43.59,49.07 44.5,49.07 44.5,48.16 44.5,47.24 44.5,46.33 45.42,46.33 27.13,45.42 28.04,45.42 28.96,45.42 29.87,45.42 30.78,45.42 31.7,45.42 32.61,45.42 33.53,45.42 34.44,45.42 35.36,45.42 27.13,44.5 28.04,44.5 28.96,44.5 29.87,44.5 30.78,44.5 31.7,44.5 32.61,44.5 33.53,44.5 34.44,44.5 35.36,44.5 27.13,43.59 28.04,43.59 28.96,43.59 29.87,43.59 30.78,43.59 31.7,43.59 32.61,43.59 33.53,43.59 34.44,43.59 35.36,43.59 35.36,46.33 35.36,47.24 35.36,48.16
  pour Top (no thermals): 23.93,43.13 23.93,50.9 50.29,50.9 50.29,43.13
  pour Route3 (no thermals): 23.93,43.13 23.93,50.9 50.29,50.9 50.29,43.13
  pour Bottom (no thermals): 23.93,43.13 23.93,50.9 50.29,50.9 50.29,43.13
UVLO
  Top 0.279: U3.2 5.53,18.03 5.49,17.98
  Top 0.406: R23.P$2 R24.P$1 5.49,17.98
VB1
  pour Top (no thermals): 43.59,12.34 43.59,14.48 44.81,15.7 50.6,15.7 50.6,12.34
VB2
  pour Top (no thermals): 28.04,12.34 34.14,12.34 34.14,15.7 29.26,15.7 28.04,14.48
VIN
  Top 0.279: U3.10 12.43,18.53 13.11,19.2
  Top 0.406: 13.11,19.2 13.41,19.51 R25.P$1 C14.P$1
VS1
  pour Top (no thermals): 46.48,17.75 44.88,17.75 44.81,17.68 42.37,17.68 41,16.31 41,0.46 44.65,0.46 44.65,6.25 43.89,7.01 43.89,9.75 42.37,9.75 41.76,10.36 41.76,14.33 43.74,16.31 46.48,16.31
VS2
  pour Top (no thermals): 30.94,17.75 29.34,17.75 29.26,17.68 26.82,17.68 25.6,16.46 25.6,12.5 26.21,12.5 26.21,14.33 28.19,16.31 30.94,16.31
  pour Top (no thermals): 26.21,14.17 26.21,10.36 26.82,9.75 28.35,9.75 28.35,7.92 29.26,7.01 29.26,0.46 25.6,0.46 25.6,14.17

### Text on the board
tPlace: VS2 | LO2 | HO2 | LO1 | HO1 | VS1
bPlace: M1 | BATT+ | BATT- | M2 | LIN1 | LIN2 | EEP_SDL | HIN1 | HIN2 | 3V3 | EEP_SDA | EEP_WC